# EAGLE board Node#1 (EAGLE 9.2.1), part 1 of 2
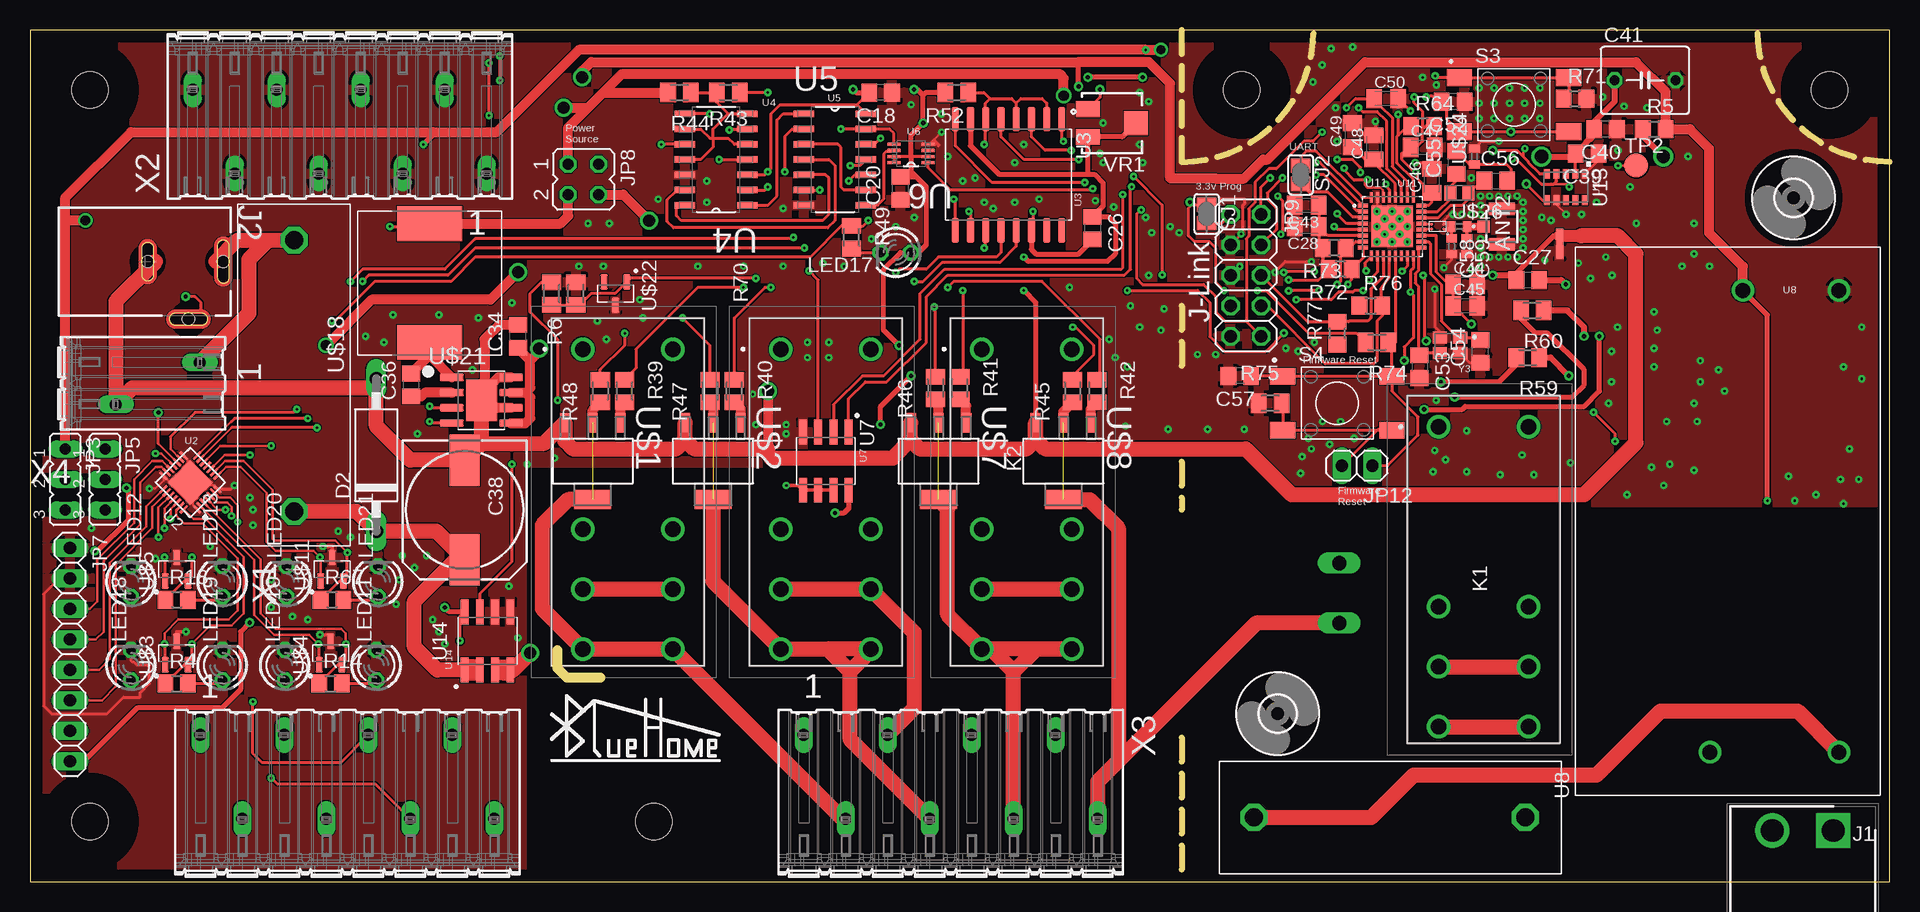
[diagram p7: board, top side]
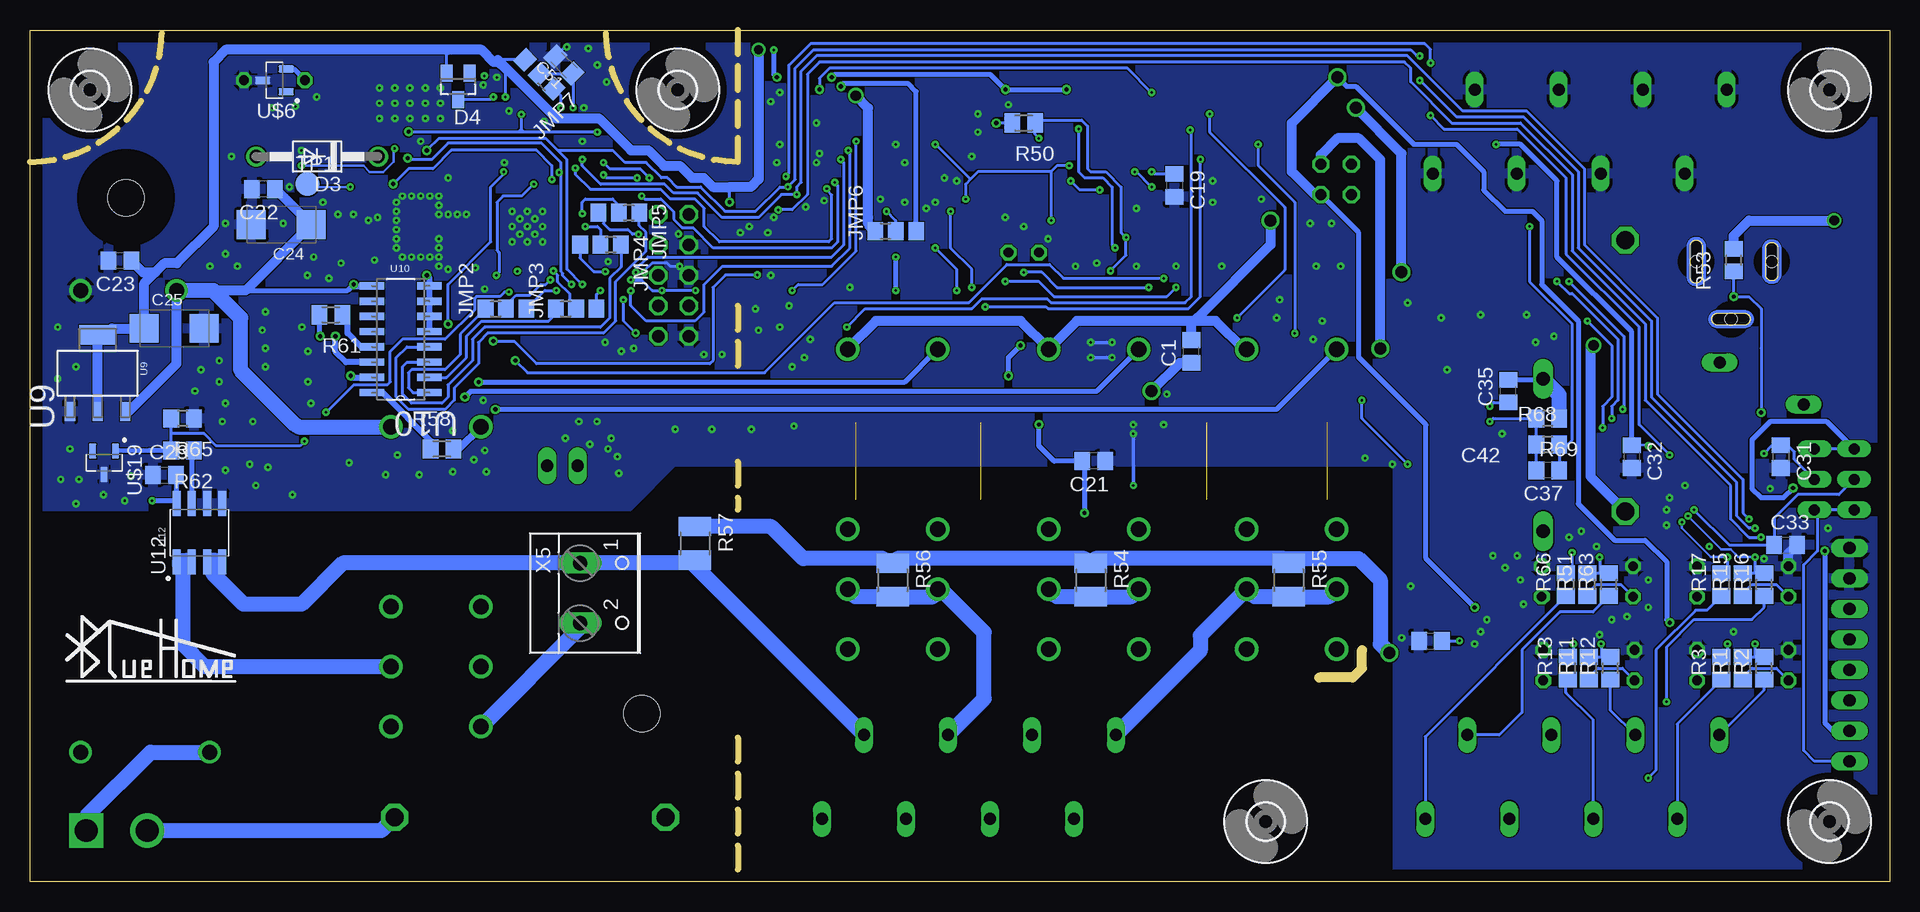
[diagram p8: board, bottom side, seen from below]

Size 155 x 71 mm. Coordinates in mm from the lower left corner, seen from the top.
Outline: 0,0 155,0 155,71 0,71 0,0
Copper layers (1*16): Top 0.035mm / dielectric 1.5mm / Bottom 0.035mm
Design rules "default *": minimum track width 8mil, minimum drill 8mil, track to track 4mil, track to pad 6mil, pad to pad 6mil, via to via 6mil, smd to smd 4mil, copper to edge 40mil, drill to drill 6mil, minimum pad ring 10mil, minimum via ring 8mil, stop-mask expansion 4mil, vias tented up to drill 12mil, thermal gap 10mil
Milling: 27 lines

## Footprints (pad centres in the part's own frame; a part is rotated, then mirrored left to right if it is on the bottom)
CONUFL001-SMD = smd 1 x 1.05: 1 0,-1.525 | smd 1.05 x 2.2: 2 -1.475,0; 3 1.475,0
C0805 = smd 1.3 x 1.5: 1 -0.95,0; 2 0.95,0
SMC_C = smd 2.4 x 2.4: + -2.5,0; - 2.5,0
C0805K = smd 1.3 x 1.6: 1 -1,0; 2 1,0
150CLZ-1010 = smd 4.3 x 2.5: + 4.15,0; - -4.15,0
C050-055X075 = drill 0.813 octagon: 1 -2.54,0; 2 2.54,0
C0402 = smd 0.7 x 0.9: 1 -0.65,0; 2 0.65,0
DO15-12 = drill 1.118 long: A 6.35,0; C -6.35,0
DO41-10 = drill 1.118: A 5.08,0; C -5.08,0
SOT23 = smd 1 x 1.4: 1 -0.95,-1.1; 2 0.95,-1.1; 3 0,1.1
SHDR2W120P0X508_1X2_1208X1200X = drill 1.9 pad 2.85 square: 1 0,0 | drill 1.9 pad 2.85: 2 5.08,0
GCT_DCJ200-10-A-XX-X_REVA = smd 0.1 x 0.1: 1 0,5.95; 2 0,0.9; 3 4.2,3.65 | hole 1: 0,0.25; 4.8,3.65; 0,6.55
A0R-JMP = smd 1.5 x 1.3: 1 0,1.7; 2 0,0; 3 0,-1.7
JP2 = drill 0.914 long: 1 -2.54,0; 2 0,0; 3 2.54,0
1X08 = drill 1.016 long: 1 -8.89,0; 2 -6.35,0; 3 -3.81,0; 4 -1.27,0; 5 1.27,0; 6 3.81,0; 7 6.35,0; 8 8.89,0
JP2Q = drill 0.914 octagon: 1 -1.27,-1.27; 2 -1.27,1.27; 3 1.27,-1.27; 4 1.27,1.27
2X05 = drill 1.016 octagon: 1 -5.08,-1.27; 2 -5.08,1.27; 3 -2.54,-1.27; 4 -2.54,1.27; 5 0,-1.27; 6 0,1.27; 7 2.54,-1.27; 8 2.54,1.27; 9 5.08,-1.27; 10 5.08,1.27
1X02 = drill 1.016 long: 1 -1.27,0; 2 1.27,0
FTRK1CK005W = drill 1.3 pad 1.95: 1 2.6,-3.75; 2 17.6,-3.75; 3 22.6,-3.75; 4 27.6,-3.75; 5 27.6,3.75; 6 22.6,3.75; 7 17.6,3.75; 8 2.6,3.75
LED3MM = drill 0.813 octagon: A -1.27,0; K 1.27,0
R0805 = smd 1.3 x 1.5: 1 -0.95,0; 2 0.95,0
M0805 = smd 1.3 x 1.6: 1 -0.95,0; 2 0.95,0
R1210 = smd 1.6 x 2.7: 1 -1.4,0; 2 1.4,0
SW_FSM4JSMAATR = smd 2.1 x 1.4: 1 -4.55,2.25; 2 4.55,2.25; 3 -4.55,-2.25; 4 4.55,-2.25
SJ = smd 1.168 x 1.6: 1 -0.762,0; 2 0.762,0
TP20R = smd 2 x 2: TP 0,0
SEMTECH_SX1503I091TRT_0 = smd 0.85 x 0.2: 1 -1.975,1.2; 2 -1.975,0.8; 3 -1.975,0.4; 4 -1.975,0; 5 -1.975,-0.4; 6 -1.975,-0.8; 7 -1.975,-1.2; 15 1.975,-1.2; 16 1.975,-0.8; 17 1.975,-0.4; 18 1.975,0; 19 1.975,0.4; 20 1.975,0.8; 21 1.975,1.2 | smd 0.2 x 0.85: 8 -1.2,-1.975; 9 -0.8,-1.975; 10 -0.4,-1.975; 11 0,-1.975; 12 0.4,-1.975; 13 0.8,-1.975; 14 1.2,-1.975; 22 1.2,1.975; 23 0.8,1.975; 24 0.4,1.975; 25 0,1.975; 26 -0.4,1.975; 27 -0.8,1.975; 28 -1.2,1.975 | smd 2.65 x 2.65: 29 0,0
SOIC127P1030X265-16N = smd 2.06 x 0.6: 1 -4.64,4.445; 2 -4.64,3.175; 3 -4.64,1.905; 4 -4.64,0.635; 5 -4.64,-0.635; 6 -4.64,-1.905; 7 -4.64,-3.175; 8 -4.64,-4.445; 9 4.64,-4.445; 10 4.64,-3.175; 11 4.64,-1.905; 12 4.64,-0.635; 13 4.64,0.635; 14 4.64,1.905; 15 4.64,3.175; 16 4.64,4.445
SOIC127P600X175-14N = smd 1.702 x 0.533: 1 -2.591,3.81; 2 -2.591,2.54; 3 -2.591,1.27; 4 -2.591,0; 5 -2.591,-1.27; 6 -2.591,-2.54; 7 -2.591,-3.81; 8 2.591,-3.81; 9 2.591,-2.54; 10 2.591,-1.27; 11 2.591,0; 12 2.591,1.27; 13 2.591,2.54; 14 2.591,3.81
SOP50P310X90-8N = smd 1.067 x 0.254: 1 -1.422,0.762; 2 -1.422,0.254; 3 -1.422,-0.254; 4 -1.422,-0.762; 5 1.422,-0.762; 6 1.422,-0.254; 7 1.422,0.254; 8 1.422,0.762
SOIC127P600X175-8N = smd 2.07 x 0.66: 1 -2.425,1.905; 2 -2.425,0.635; 3 -2.425,-0.635; 4 -2.425,-1.905; 5 2.425,-1.905; 6 2.425,-0.635; 7 2.425,0.635; 8 2.425,1.905
CONV_IRM-05-5 = drill 1.24: AC/L -19.25,-9.25; AC/N -19.25,1.5; VNEG 19.25,-9.25; VPOS 19.25,-1.25
SOT230P696X180-4N = smd 1.6 x 0.838: 1 -3.2,2.311; 2 -3.2,0; 3 -3.2,-2.311 | smd 1.6 x 3.099: 4 3.2,0
SOIC127P600X175-16N = smd 2.057 x 0.61: 1 -4.801,8.89; 2 -4.801,7.62; 3 -4.801,6.35; 4 -4.801,5.08; 5 -4.801,3.81; 6 -4.801,2.54; 7 -4.801,1.27; 8 -4.801,0; 9 0,0; 10 0,1.27; 11 0,2.54; 12 0,3.81; 13 0,5.08; 14 0,6.35; 15 0,7.62; 16 0,8.89
QFN50P500X500X100-33T345N = smd 0.84 x 0.29: 1 -2.435,1.75; 2 -2.435,1.25; 3 -2.435,0.75; 4 -2.435,0.25; 5 -2.435,-0.25; 6 -2.435,-0.75; 7 -2.435,-1.25; 8 -2.435,-1.75; 17 2.435,-1.75; 18 2.435,-1.25; 19 2.435,-0.75; 20 2.435,-0.25; 21 2.435,0.25; 22 2.435,0.75; 23 2.435,1.25; 24 2.435,1.75 | smd 0.29 x 0.84: 9 -1.75,-2.435; 10 -1.25,-2.435; 11 -0.75,-2.435; 12 -0.25,-2.435; 13 0.25,-2.435; 14 0.75,-2.435; 15 1.25,-2.435; 16 1.75,-2.435; 25 1.75,2.435; 26 1.25,2.435; 27 0.75,2.435; 28 0.25,2.435; 29 -0.25,2.435; 30 -0.75,2.435; 31 -1.25,2.435; 32 -1.75,2.435 | smd 3.45 x 3.45: 33 0,0
RTC-C3 = smd 0.8 x 0.5: P$1 -1.1,1.6; P$2 -1.1,0.8; P$3 -1.1,0; P$4 -1.1,-0.8; P$5 -1.1,-1.6; P$6 1.1,-1.6; P$7 1.1,-0.8; P$8 1.1,0; P$9 1.1,0.8; P$10 1.1,1.6
SOT95P230X110-3N = smd 1.26 x 0.59: 1 -0.98,0.95; 2 -0.98,-0.95; 3 0.98,0
RND170-00004 = drill 1.5 octagon: P$1 0,0; P$2 -22.6,0
3,0 = hole 3: 0,0
INDM1200X1200X1000N = smd 2.9 x 5.4: 1 -4.95,0; 2 4.95,0
SOIC127P600X170-8N = smd 1.97 x 0.6: 1 -2.475,1.905; 2 -2.475,0.635; 3 -2.475,-0.635; 4 -2.475,-1.905; 5 2.475,-1.905; 6 2.475,-0.635; 7 2.475,0.635; 8 2.475,1.905 | smd 2.58 x 3.45: 9 0,0
STAR_GROUND = smd 1.27 x 0.635: P$1 0.635,0; P$2 -0.635,0
R0402 = smd 0.7 x 0.9: 1 -0.65,0; 2 0.65,0
FLIPCHIP = smd 0.255 x 0.255: A1 -0.5,0.2; A2 -0.5,-0.2; B1 0.5,0.2; B2 0.5,-0.2
TRIM_TS53YJ103MR10 = smd 2 x 1.3: A 2,1.15; C 2,-1.15 | smd 2 x 2: B -2,0
P-2081-1228 = drill 1 long: L1 -4.85,-12.25; L2 2.15,-8.75; L3 -4.85,-5.25; L4 2.15,-1.75; L5 -4.85,1.75; L6 2.15,5.25; L7 -4.85,8.75; L8 2.15,12.25
P-2081-1222 = drill 1 long: L1 -4.85,-1.75; L2 2.15,1.75
W237-102 = drill 1.194 long: 1 -2.5,-1.27; 2 2.5,-1.27
XTAL_ECS-160-12-36-AGN-TR = smd 1.2 x 1: 1 -0.85,-0.65; 2 0.85,-0.65; 3 0.85,0.65; 4 -0.85,0.65
XTAL_NX2012SA-32.768K-STD-MUB-1 = smd 1 x 1.25: 1 -0.75,0; 2 0.75,0

## Placement (x,y rotation side)
ANT2  CONUFL001-SMD  [CONUFL001-SMD]  122.69,54.61 270 top
C1  [C0805]  58.2,44.2 90 bottom
C18  [C0805]  70.9,65.79 180 top
C19  [C0805]  59.6,58.04 270 bottom
C20  [C0805]  72.55,57.78 90 top
C21  [C0805]  66.33,35.05 180 bottom
C22  [C0805]  135.55,57.74 180 bottom
C23  [C0805]  147.5,51.75 180 bottom
C24  [SMC_C]  134.05,54.77 180 bottom
C25  [SMC_C]  142.97,46.12 0 bottom
C26  [C0805]  88.56,54.48 270 top
C27  [C0805]  124.84,50.16 0 top
C28  [C0805K]  106.43,54.61 180 top
C29  [C0805]  143.8,33.91 0 bottom
C31  [C0805]  9.05,35.43 270 bottom
C32  [C0805]  21.5,35.43 270 bottom
C33  [C0805]  8.67,28.07 0 bottom
C34  [C0805]  40.68,45.47 90 top
C35  [C0805]  31.79,40.89 90 bottom
C36  [C0805]  31.79,41.4 90 top
C37  [C0805]  28.48,34.29 180 bottom
C38  [150CLZ-1010]  36.23,30.99 270 top
C39  1u  [C0805]  129.8,60.71 180 top
C40  100n  [C0805]  131.32,62.74 180 top
C41  100mF  [C050-055X075]  134.62,66.8 0 top
C42  [C0805]  38.26,20.07 0 bottom
C43  [C0805K]  106.43,56.39 180 top
C44  [C0805K]  119.64,49.78 0 top
C45  [C0805K]  119.64,48.01 0 top
C46  [C0805K]  116.84,58.42 90 top
C47  [C0805K]  116.08,61.21 0 top
C48  [C0805K]  112.02,61.21 90 top
C49  [C0805K]  110.24,62.23 90 top
C50  [C0805K]  113.03,65.28 0 top
C51  [C0805K]  110.49,68.07 135 bottom
C52  [C0805]  118.62,65.02 180 top
C53  [C0805]  115.83,42.93 270 top
C54  [C0805]  120.91,44.2 90 top
C55  [C0805]  118.88,59.94 90 top
C56  [C0805]  122.18,58.42 0 top
C57  [C0805]  100.84,42.16 180 top
C58  [C0402]  118.5,52.96 270 top
C59  [C0402]  119.77,52.96 270 top
D2  1N5060GP  [DO15-12]  28.86,35.56 90 top
D3  MUR150RL  [DO41-10]  131.07,60.45 180 bottom
D4  BAS40-06  [SOT23]  119.32,66.29 180 bottom
J1  1757242  [SHDR2W120P0X508_1X2_1208X1200X]  150.31,4.26 180 top
J2  DCJ200-10-A-XX-X_REVA  [GCT_DCJ200-10-A-XX-X_REVA]  9.56,51.69 270 top
JMP2  0R-JUMPA  [A0R-JMP]  115.32,47.75 90 bottom
JMP3  0R-JUMPA  [A0R-JMP]  109.48,47.75 90 bottom
JMP4  0R-JUMPA  [A0R-JMP]  107.45,53.09 270 bottom
JMP5  0R-JUMPA  [A0R-JMP]  105.92,55.75 270 bottom
JMP6  0R-JUMPA  [A0R-JMP]  82.84,54.23 90 bottom
JMP7  0R-JUMPA  [A0R-JMP]  112.53,67.31 225 bottom
JP3  [JP2]  2.96,33.53 270 top
JP5  [JP2]  6.26,33.53 270 top
JP7  [1X08]  3.34,18.92 270 top
JP8  [JP2Q]  46.14,58.55 270 top
JP9  [2X05]  101.35,50.55 270 top
JP12  [1X02]  110.62,34.67 180 top
K1  FTR-K1CK005W  [FTRK1CK005W]  121.16,40.51 270 top
K2  FTR-K1CK005W  [FTRK1CK005W]  83.09,46.99 270 top
K3  FTR-K1CK005W  [FTRK1CK005W]  66.33,46.99 270 top
K4  FTR-K1CK005W  [FTRK1CK005W]  49.82,46.99 270 top
LED10  [LED3MM]  21.25,18.03 90 top
LED11  [LED3MM]  28.86,18.03 90 top
LED12  [LED3MM]  8.42,25.02 90 top
LED13  [LED3MM]  16.04,25.02 90 top
LED17  [LED3MM]  72.17,52.45 180 top
LED18  [LED3MM]  8.42,18.03 90 top
LED19  [LED3MM]  16.04,18.03 90 top
LED20  [LED3MM]  21.37,25.02 90 top
LED21  [LED3MM]  28.99,25.02 90 top
R1  [R0805]  12.23,17.78 90 bottom
R2  [R0805]  10.45,17.78 90 bottom
R3  [R0805]  14.01,17.78 90 bottom
R4  [R0805]  12.23,16.51 0 top
R5  [R0805]  135.39,62.74 0 top
R6  [M0805]  43.47,49.02 270 top
R11  [R0805]  25.06,17.78 90 bottom
R12  [R0805]  23.28,17.78 90 bottom
R13  [R0805]  26.83,17.78 90 bottom
R14  [R0805]  25.06,16.51 0 top
R15  [R0805]  12.23,24.77 90 bottom
R16  [R0805]  10.45,24.77 90 bottom
R17  [R0805]  14.01,24.77 90 bottom
R18  [R0805]  12.23,23.5 0 top
R39  [M0805]  49.57,40.89 270 top
R40  [M0805]  58.71,40.89 270 top
R41  [M0805]  77.51,41.15 270 top
R42  [M0805]  88.94,40.89 270 top
R43  [M0805]  58.2,65.79 180 top
R44  [M0805]  54.14,65.79 180 top
R45  [M0805]  86.9,40.89 90 top
R46  [M0805]  75.47,41.15 90 top
R47  [M0805]  56.68,40.89 90 top
R48  [M0805]  47.53,40.89 90 top
R49  [M0805]  68.49,53.72 270 top
R50  [M0805]  72.17,63.25 180 bottom
R51  [R0805]  25.18,24.77 90 bottom
R52  [M0805]  77.25,65.79 180 top
R53  [R0805]  12.99,51.82 90 bottom
R54  [R1210]  66.58,25.15 270 bottom
R55  [R1210]  50.07,25.15 270 bottom
R56  [R1210]  83.09,25.15 270 bottom
R57  [R1210]  99.57,28.19 270 bottom
R58  [M0805]  120.65,36.07 0 bottom
R59  [M0805]  124.84,43.69 180 top
R60  [M0805]  125.23,47.62 180 top
R61  [M0805]  129.93,47.24 180 bottom
R62  [R0805]  142.28,35.94 180 bottom
R63  [R0805]  23.4,24.77 90 bottom
R64  [R0805]  116.08,62.99 0 top
R65  [R0805]  142.28,38.61 180 bottom
R66  [R0805]  26.96,24.77 90 bottom
R67  [R0805]  25.18,23.5 0 top
R68  [R0805]  28.48,36.45 0 bottom
R69  [R0805]  28.48,38.61 180 bottom
R70  [M0805]  45.5,49.02 270 top
R71  [R0805]  128.78,65.28 0 top
R72  [R0805]  109.22,51.05 180 top
R73  [R0805]  108.72,52.83 180 top
R74  [M0805]  112.27,44.96 180 top
R75  [M0805]  103.38,39.88 0 top
R76  [R0805]  111.76,48.01 0 top
R77  [R0805]  108.97,45.72 90 top
S3  FSM4JSMAATR  [SW_FSM4JSMAATR]  123.7,64.77 0 top
S4  FSM4JSMAATR  [SW_FSM4JSMAATR]  108.97,39.88 0 top
SJ1  [SJ]  98.08,55.66 270 top
SJ2  [SJ]  105.92,58.93 270 top
TP1  PTR1TP20R  [TP20R]  131.86,58.17 0 bottom
TP2  PTR1TP20R  [TP20R]  133.89,59.69 0 top
U2  SEMTECH_SX1503I091TRTSEMTECH_SX1503I091TRT_0_0  [SEMTECH_SX1503I091TRT_0]  13.37,33.27 135 top
U3  MIC4468YWM  [SOIC127P1030X265-16N]  81.57,58.93 270 top
U4  LM339ADR  [SOIC127P600X175-14N]  57.19,60.2 180 top
U5  74HC08D,652  [SOIC127P600X175-14N]  67.09,60.2 0 top
U6  SN74LVC1G74DCUR  [SOP50P310X90-8N]  73.44,60.71 180 top
U7  TMP75BID  [SOIC127P600X175-8N]  66.33,35.05 270 top
U8  IRM-05-5  [CONV_IRM-05-5]  141.53,30.04 90 top
U9  LMS8117AMP-3.3  [SOT230P696X180-4N]  149.36,42.39 90 bottom
U10  ULN2003AIDG4  [SOIC127P600X175-16N]  126.5,49.66 180 bottom
U11  BLUENRG-232  [QFN50P500X500X100-33T345N]  113.54,54.61 0 top
U12  ACS723LLCTR-40AB-T  [SOIC127P600X175-8N]  140.88,29.08 90 bottom
U13  RV8564C3  [RTC-C3]  128.02,57.91 270 top
U14  ACS723LLCTR-40AB-T  [SOIC127P600X175-8N]  38.14,20.07 90 top
U$1  BUK9840-55  [SOT230P696X180-4N]  46.9,35.05 270 top
U$2  BUK9840-55  [SOT230P696X180-4N]  56.93,35.05 270 top
U$3  BZB984  [SOT95P230X110-3N]  12.23,19.05 90 top
U$4  BZB984  [SOT95P230X110-3N]  25.06,19.05 90 top
U$5  BZB984  [SOT95P230X110-3N]  12.23,26.04 90 top
U$6  BZB984  [SOT95P230X110-3N]  134.62,66.8 180 bottom
U$7  BUK9840-55  [SOT230P696X180-4N]  75.73,35.05 270 top
U$8  BUK9840-55  [SOT230P696X180-4N]  86.14,35.05 270 top
U$9  RND170-00004  [RND170-00004]  124.62,5.33 0 top
U$10  [3,0]  104,14 0 top
U$11  BZB984  [SOT95P230X110-3N]  25.18,26.04 90 top
U$12  [3,0]  101,66 0 bottom
U$13  [3,0]  150,66 0 bottom
U$14  [3,0]  147,57 0 top
U$15  [3,0]  5,66 0 bottom
U$16  [3,0]  5,5 0 bottom
U$17  [3,0]  52,5 0 bottom
U$18  LIND  [INDM1200X1200X1000N]  33.31,49.91 90 top
U$19  BZB984  [SOT95P230X110-3N]  148.83,34.91 270 bottom
U$20  RND170-00004  [RND170-00004]  22.01,53.47 90 top
U$21  LM23610  [SOIC127P600X170-8N]  37.63,40.13 0 top
U$22  BZB984  [SOT95P230X110-3N]  48.8,49.02 270 top
U$23  STAR_GROUND  [STAR_GROUND]  127.5,53.18 90 top
U$24  L0402  [R0402]  120.4,60.45 90 top
U$25  BALF-NRG-01D3  [FLIPCHIP]  117.35,54.61 180 top
U$26  L0402  [R0402]  119.13,54.61 0 top
VR1  TS53YJ103MR10  [TRIM_TS53YJ103MR10]  90.21,63.25 180 top
X1  2081-1228  [P-2081-1228]  26.45,7.37 270 top
X2  2081-1228  [P-2081-1228]  25.82,63.88 90 top
X3  2081-1228  [P-2081-1228]  76.74,7.37 270 top
X4  2081-1222  [P-2081-1222]  9.31,41.53 180 top
X5  [W237-102]  107.87,24.05 270 bottom
Y3  ECS-160-12-36-AGN-TR  [XTAL_ECS-160-12-36-AGN-TR]  118.37,44.7 180 top
Y4  NX2012SA-32.768K-STD-MUB-1  [XTAL_NX2012SA-32.768K-STD-MUB-1]  119.13,57.4 180 top